# Altium schematic sheet ResSelect.SchDoc: TITRE
size Letter; ApprovedBy: APPROUVÉ PAR; Organization: Cegep Limoilou; Address1: 1300, 8e Avenue; Address2: Québec, QC; Address3: Canada; Address4: G1J 5L5; SheetNumber: 4; SheetTotal: 5
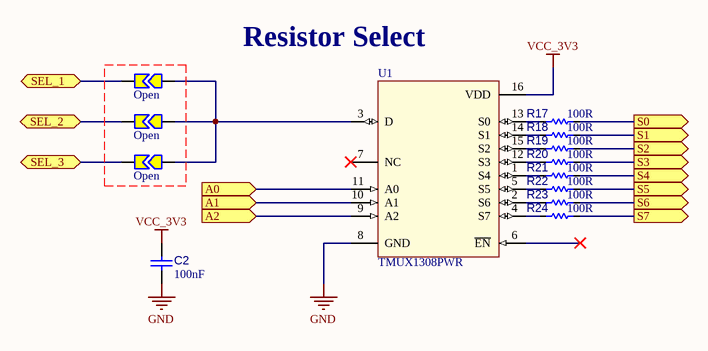
[diagram p0: ResSelect.SchDoc]

## Parts
C2  value 100nF  [C_1608[0603]]  (hidden comment: CAP CER 100nF 50V 0603)
R17  value 100R  [R_1608[0603]]  (hidden comment: Res 100R 1% 0603)
R18  value 100R  [R_1608[0603]]  (hidden comment: Res 100R 1% 0603)
R19  value 100R  [R_1608[0603]]  (hidden comment: Res 100R 1% 0603)
R20  value 100R  [R_1608[0603]]  (hidden comment: Res 100R 1% 0603)
R21  value 100R  [R_1608[0603]]  (hidden comment: Res 100R 1% 0603)
R22  value 100R  [R_1608[0603]]  (hidden comment: Res 100R 1% 0603)
R23  value 100R  [R_1608[0603]]  (hidden comment: Res 100R 1% 0603)
R24  value 100R  [R_1608[0603]]  (hidden comment: Res 100R 1% 0603)
SB1  Open  [SB-TINY-OPEN]  (no BOM)
SB2  Open  [SB-TINY-OPEN]  (no BOM)
SB3  Open  [SB-TINY-OPEN]  (no BOM)
U1  TMUX1308PWR  [U_TSSOP65P500X450-16]

## Ports
A0 (in), A1 (in), A2 (in), S0 (out), S1 (out), S2 (out), S3 (out), S4 (out), S5 (out), S6 (out), S7 (out), SEL_1 (bidir), SEL_2 (bidir), SEL_3 (bidir)

## Nets
GND: C2.1 U1.8(GND)
VCC_3V3: C2.2 U1.16(VDD)
A0: U1.11(A0) ; port A0
A1: U1.10(A1) ; port A1
A2: U1.9(A2) ; port A2
S0: R17.2 ; port S0
S1: R18.2 ; port S1
S2: R19.2 ; port S2
S3: R20.2 ; port S3
S4: R21.2 ; port S4
S5: R22.2 ; port S5
S6: R23.2 ; port S6
S7: R24.2 ; port S7
SEL_1: SB1.2 ; port SEL_1
SEL_2: SB2.2 ; port SEL_2
SEL_3: SB3.2 ; port SEL_3
NetR17_1: R17.1 U1.13(S0)
NetR18_1: R18.1 U1.14(S1)
NetR19_1: R19.1 U1.15(S2)
NetR20_1: R20.1 U1.12(S3)
NetR21_1: R21.1 U1.1(S4)
NetR22_1: R22.1 U1.5(S5)
NetR23_1: R23.1 U1.2(S6)
NetR24_1: R24.1 U1.4(S7)
NetSB1_1: SB1.1 SB2.1 SB3.1 U1.3(D)

Not connected (* = marked no-connect by the designer): U1 6(~{EN})* 7(NC)*

## Notes on the sheet
- (near U1) Resistor Select
- Titre :
- Conception :
- Date :
- Approbation :
- Heure :
- Révision :
- Feuille
- de
- Fichier :

## Library data of the parts
C2 = CAP002: Capacitor type 1; Manufacturer 1: Yageo; Manufacturer Part Number 1: CC0603KRX7R9BB104; LibRef: CAP002; Code CEGEP: COND0143SM; Tolerance: 10%; Dielectric: X7R; Rated Voltage: 50V; Mounting Technology: SMT; Supplier 1: LCSC; Supplier Part Number 1: C14663
R17-R24 = RES029: Resistor type 1; Manufacturer 1: Yageo; Manufacturer Part Number 1: RC0603FR-07100RL; LibRef: RES029; Puissance: 1/10W; Max Working Voltage: 75V; Tolerance: 1%; Mounting Technology: SMT; Supplier 1: LCSC; Supplier Part Number 1: C105588
SB1-SB3 = Solder-Jumper-Open: Solder Jumper
U1 = U_TMUX1308PWR: IC MUX 8:1 195OHM 16TSSOP; Manufacturer 1: TI; Manufacturer Part Number 1: TMUX1308PWR; Mounting Technology: SMT; Supplier 1: LCSC; Supplier 2: Digikey; Supplier Part Number 1: C970231; Supplier Part Number 2: 296-TMUX1308PWRCT-ND